# EAGLE schematic SteppyMk2 (EAGLE 9.2.2)
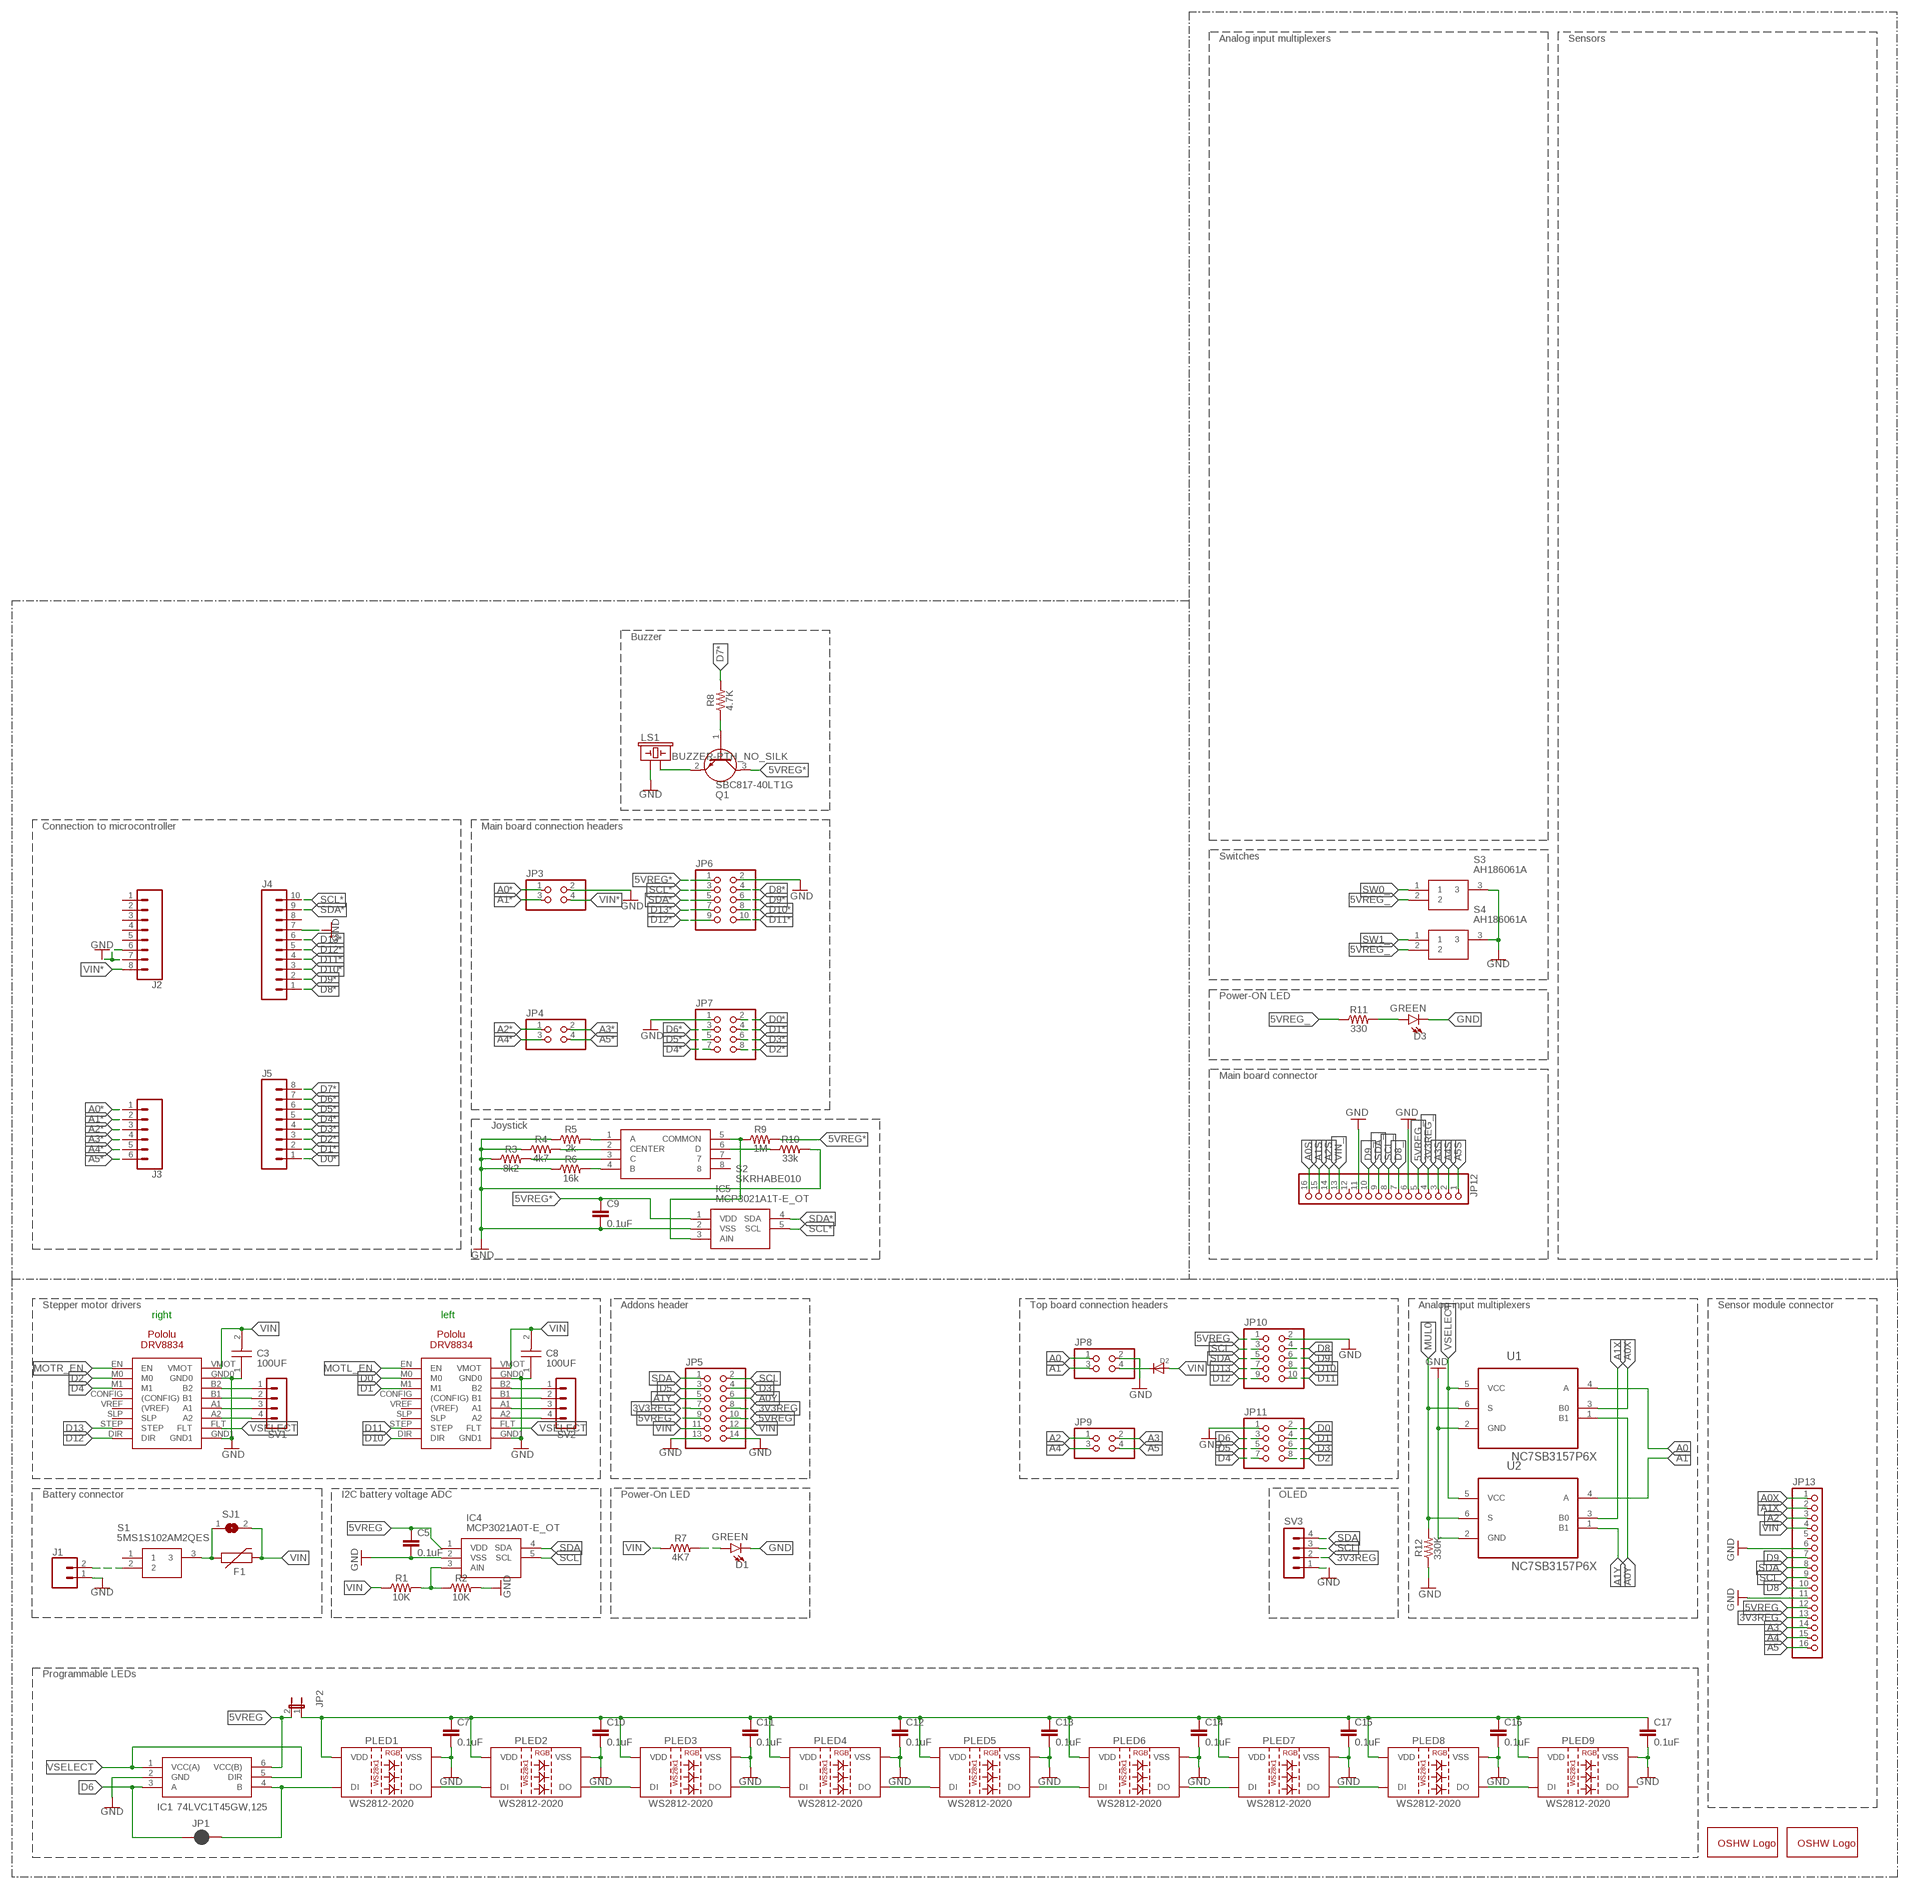
[diagram p0: schematic, sheet 1, part 1 of 3]
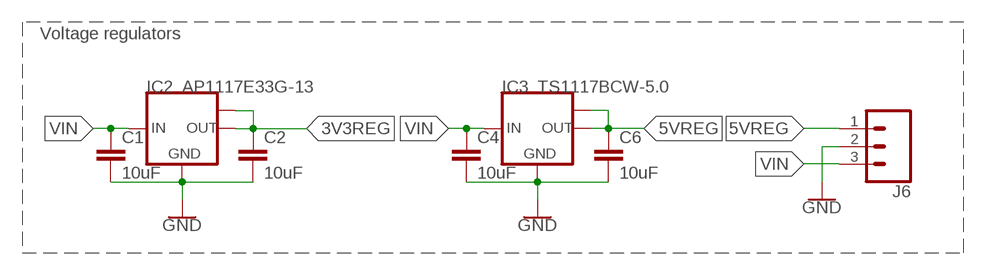
[diagram p1: schematic, sheet 1, part 2 of 3]
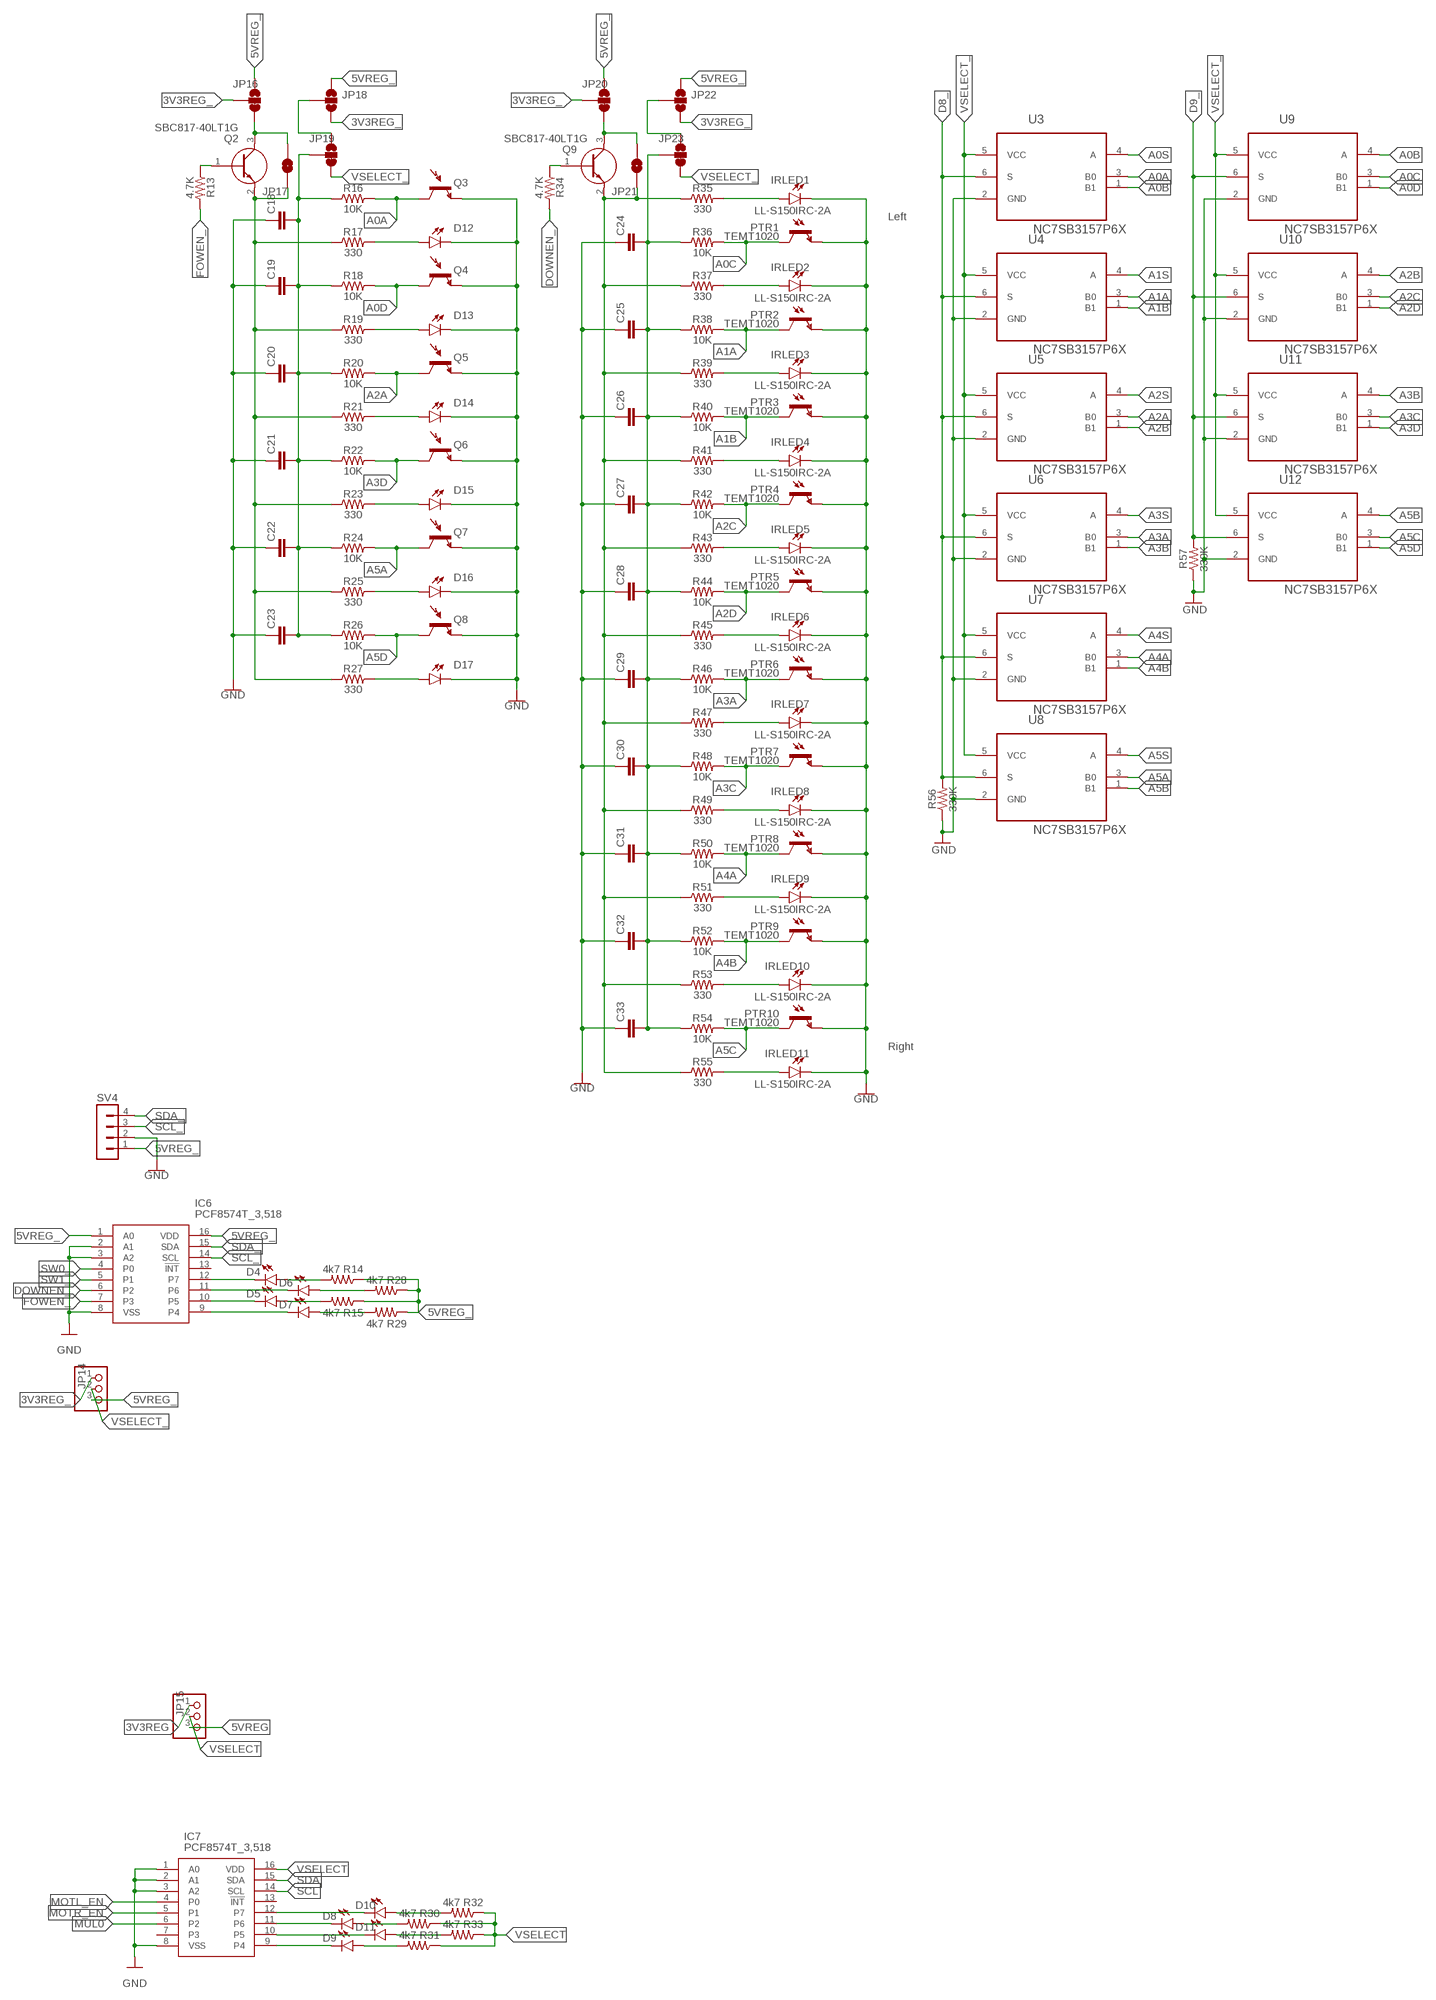
[diagram p2: schematic, sheet 1, part 3 of 3]

## Parts
C1  10uF  10UF-0805-10V-10%  [0805]
C2  10uF  10UF-0805-10V-10%  [0805]
C3  100UF  EEEFK1C101P  [CAPM7058X610N]
C4  10uF  10UF-0805-10V-10%  [0805]
C5  0.1uF  0.1UF-0603-25V-5%  [0603]
C6  10uF  10UF-0805-10V-10%  [0805]
C7  0.1uF  C-EUC0805  [C0805]
C8  100UF  EEEFK1C101P  [CAPM7058X610N]
C9  0.1uF  C-EUC0805  [C0805]
C10  0.1uF  C-EUC0805  [C0805]
C11  0.1uF  C-EUC0805  [C0805]
C12  0.1uF  C-EUC0805  [C0805]
C13  0.1uF  C-EUC0805  [C0805]
C14  0.1uF  C-EUC0805  [C0805]
C15  0.1uF  C-EUC0805  [C0805]
C16  0.1uF  C-EUC0805  [C0805]
C17  0.1uF  C-EUC0805  [C0805]
C18  C-EUC0805  [C0805]
C19  C-EUC0805  [C0805]
C20  C-EUC0805  [C0805]
C21  C-EUC0805  [C0805]
C22  C-EUC0805  [C0805]
C23  C-EUC0805  [C0805]
C24  C-EUC0805  [C0805]
C25  C-EUC0805  [C0805]
C26  C-EUC0805  [C0805]
C27  C-EUC0805  [C0805]
C28  C-EUC0805  [C0805]
C29  C-EUC0805  [C0805]
C30  C-EUC0805  [C0805]
C31  C-EUC0805  [C0805]
C32  C-EUC0805  [C0805]
C33  C-EUC0805  [C0805]
D1  GREEN  LED-GREEN1206  [LED-1206]
D2  DIODESMA  [SMADIODE]
D3  GREEN  LED-GREEN1206  [LED-1206]
D4  GREEN  LED-GREEN1206  [LED-1206]
D5  GREEN  LED-GREEN1206  [LED-1206]
D6  GREEN  LED-GREEN1206  [LED-1206]
D7  GREEN  LED-GREEN1206  [LED-1206]
D8  GREEN  LED-GREEN1206  [LED-1206]
D9  GREEN  LED-GREEN1206  [LED-1206]
D10  GREEN  LED-GREEN1206  [LED-1206]
D11  GREEN  LED-GREEN1206  [LED-1206]
D12  LED-IRSIDE_EMITTER  [LTE-302]
D13  LED-IRSIDE_EMITTER  [LTE-302]
D14  LED-IRSIDE_EMITTER  [LTE-302]
D15  LED-IRSIDE_EMITTER  [LTE-302]
D16  LED-IRSIDE_EMITTER  [LTE-302]
D17  LED-IRSIDE_EMITTER  [LTE-302]
DRV1  POLOLU-DRV8825  [POLOLU-DRV8825]
DRV2  POLOLU-DRV8825  [POLOLU-DRV8825]
F1  PPTC_PTH  [PTH]
GOLD_ORB_SM1  OSHWLOGOLOGO8MM  [OSHW_8MM]
GOLD_ORB_SM2  OSHWLOGOLOGO5MM  [OSHW_5MM]
IC1  74LVC1T45GW,125  [SOT65P210X110-6N]
IC2  AP1117E33G-13  LM1117IMPX-3.3  [SOT223]
IC3  TS1117BCW-5.0  LM1117IMPX-5.0  [SOT223]
IC4  MCP3021A0T-E_OT  [SOT95P280X145-5N]
IC5  MCP3021A1T-E_OT  MCP3021A0T-E_OT  [SOT95P280X145-5N]
IC6  PCF8574T_3,518  [SOIC127P1032X265-16N]
IC7  PCF8574T_3,518  [SOIC127P1032X265-16N]
IRLED1  LL-S150IRC-2A  PT15-21C_TR8  [LEDC3215X130N]
IRLED2  LL-S150IRC-2A  PT15-21C_TR8  [LEDC3215X130N]
IRLED3  LL-S150IRC-2A  PT15-21C_TR8  [LEDC3215X130N]
IRLED4  LL-S150IRC-2A  PT15-21C_TR8  [LEDC3215X130N]
IRLED5  LL-S150IRC-2A  PT15-21C_TR8  [LEDC3215X130N]
IRLED6  LL-S150IRC-2A  PT15-21C_TR8  [LEDC3215X130N]
IRLED7  LL-S150IRC-2A  PT15-21C_TR8  [LEDC3215X130N]
IRLED8  LL-S150IRC-2A  PT15-21C_TR8  [LEDC3215X130N]
IRLED9  LL-S150IRC-2A  PT15-21C_TR8  [LEDC3215X130N]
IRLED10  LL-S150IRC-2A  PT15-21C_TR8  [LEDC3215X130N]
IRLED11  LL-S150IRC-2A  PT15-21C_TR8  [LEDC3215X130N]
J1  CONN_02  [1X02]
J2  CONN_08"  [1X08]
J3  CONN_06SILK_FEMALE_PTH  [1X06]
J4  CONN_10"  [1X10]
J5  CONN_08"  [1X08]
J6  455-1750-1-ND  CONN_03  [1X03]
JP1  JUMPER-SMT_2_NC_PASTE_SILK  [SMT-JUMPER_2_NC_PASTE_SILK]
JP2  JP1E  [JP1]
JP3  PINHD-2X2  [2X02]
JP4  PINHD-2X2  [2X02]
JP5  PINHD-2X7  [2X07]
JP6  PINHD-2X5  [2X05]
JP7  PINHD-2X4  [2X04]
JP8  PINHD-2X2  [2X02]
JP9  PINHD-2X2  [2X02]
JP10  PINHD-2X5  [2X05]
JP11  PINHD-2X4  [2X04]
JP12  PINHD-1X16/90  [1X16/90]
JP13  PINHD-1X16  [1X16]
JP14  PINHD-1X3  [1X03]
JP15  PINHD-1X3  [1X03]
JP16  JUMPER-SMT_3_1-NC_TRACE_NO-SILK  [SMT-JUMPER_3_1-NC_TRACE_NO-SILK]
JP17  JUMPER-SMT_2_NO_NO-SILK  [SMT-JUMPER_2_NO_NO-SILK]
JP18  JUMPER-SMT_3_NO_NO_SILK  [SMT-JUMPER_3_0-NO_TRACE_NO-SILK]
JP19  JUMPER-SMT_3_1-NC_TRACE_NO-SILK  [SMT-JUMPER_3_1-NC_TRACE_NO-SILK]
JP20  JUMPER-SMT_3_1-NC_TRACE_NO-SILK  [SMT-JUMPER_3_1-NC_TRACE_NO-SILK]
JP21  JUMPER-SMT_2_NO_NO-SILK  [SMT-JUMPER_2_NO_NO-SILK]
JP22  JUMPER-SMT_3_NO_NO_SILK  [SMT-JUMPER_3_0-NO_TRACE_NO-SILK]
JP23  JUMPER-SMT_3_1-NC_TRACE_NO-SILK  [SMT-JUMPER_3_1-NC_TRACE_NO-SILK]
LS1  BUZZER-PTH_NO_SILK  [BUZZER-12MM-NS]
PLED1  WS2812-2020  [WS2812-2020]
PLED2  WS2812-2020  [WS2812-2020]
PLED3  WS2812-2020  [WS2812-2020]
PLED4  WS2812-2020  [WS2812-2020]
PLED5  WS2812-2020  [WS2812-2020]
PLED6  WS2812-2020  [WS2812-2020]
PLED7  WS2812-2020  [WS2812-2020]
PLED8  WS2812-2020  [WS2812-2020]
PLED9  WS2812-2020  [WS2812-2020]
PTR1  TEMT1020  [TEMT1020]
PTR2  TEMT1020  [TEMT1020]
PTR3  TEMT1020  [TEMT1020]
PTR4  TEMT1020  [TEMT1020]
PTR5  TEMT1020  [TEMT1020]
PTR6  TEMT1020  [TEMT1020]
PTR7  TEMT1020  [TEMT1020]
PTR8  TEMT1020  [TEMT1020]
PTR9  TEMT1020  [TEMT1020]
PTR10  TEMT1020  [TEMT1020]
Q1  SBC817-40LT1G  [SOT96P237X111-3N]
Q2  SBC817-40LT1G  [SOT96P237X111-3N]
Q3  LTR-301  [LTR-301]
Q4  LTR-301  [LTR-301]
Q5  LTR-301  [LTR-301]
Q6  LTR-301  [LTR-301]
Q7  LTR-301  [LTR-301]
Q8  LTR-301  [LTR-301]
Q9  SBC817-40LT1G  [SOT96P237X111-3N]
R1  10K  RESISTOR0805  [0805]
R2  10K  RESISTOR0805  [0805]
R3  8k2  RESISTOR0805  [0805]
R4  4k7  RESISTOR0805  [0805]
R5  2k  RESISTOR0805  [0805]
R6  16k  RESISTOR0805  [0805]
R7  4K7  RESISTOR0805  [0805]
R8  4.7K  RESISTOR0805  [0805]
R9  1M  RESISTOR0805  [0805]
R10  33k  RESISTOR0805  [0805]
R11  330  RESISTOR0805  [0805]
R12  330K  RESISTOR0805  [0805]
R13  4.7K  RESISTOR0805  [0805]
R14  4k7  RESISTOR0805  [0805]
R15  4k7  RESISTOR0805  [0805]
R16  10K  RESISTOR0805  [0805]
R17  330  RESISTOR0805  [0805]
R18  10K  RESISTOR0805  [0805]
R19  330  RESISTOR0805  [0805]
R20  10K  RESISTOR0805  [0805]
R21  330  RESISTOR0805  [0805]
R22  10K  RESISTOR0805  [0805]
R23  330  RESISTOR0805  [0805]
R24  10K  RESISTOR0805  [0805]
R25  330  RESISTOR0805  [0805]
R26  10K  RESISTOR0805  [0805]
R27  330  RESISTOR0805  [0805]
R28  4k7  RESISTOR0805  [0805]
R29  4k7  RESISTOR0805  [0805]
R30  4k7  RESISTOR0805  [0805]
R31  4k7  RESISTOR0805  [0805]
R32  4k7  RESISTOR0805  [0805]
R33  4k7  RESISTOR0805  [0805]
R34  4.7K  RESISTOR0805  [0805]
R35  330  RESISTOR0805  [0805]
R36  10K  RESISTOR0805  [0805]
R37  330  RESISTOR0805  [0805]
R38  10K  RESISTOR0805  [0805]
R39  330  RESISTOR0805  [0805]
R40  10K  RESISTOR0805  [0805]
R41  330  RESISTOR0805  [0805]
R42  10K  RESISTOR0805  [0805]
R43  330  RESISTOR0805  [0805]
R44  10K  RESISTOR0805  [0805]
R45  330  RESISTOR0805  [0805]
R46  10K  RESISTOR0805  [0805]
R47  330  RESISTOR0805  [0805]
R48  10K  RESISTOR0805  [0805]
R49  330  RESISTOR0805  [0805]
R50  10K  RESISTOR0805  [0805]
R51  330  RESISTOR0805  [0805]
R52  10K  RESISTOR0805  [0805]
R53  330  RESISTOR0805  [0805]
R54  10K  RESISTOR0805  [0805]
R55  330  RESISTOR0805  [0805]
R56  330K  RESISTOR0805  [0805]
R57  330K  RESISTOR0805  [0805]
S1  5MS1S102AM2QES  [5MS1S102AM2QES]
S2  SKRHABE010  [SKRHABE010]
S3  AH186061A  [AH186061A]
S4  AH186061A  [AH186061A]
SJ1  SJW  [SJW]
SV1  MA04-1  [MA04-1]
SV2  MA04-1  [MA04-1]
SV3  MA04-1  [MA04-1]
SV4  MA04-1  [MA04-1]
U1  NC7SB3157P6X  [SOT65P210X110-6N]
U2  NC7SB3157P6X  [SOT65P210X110-6N]
U3  NC7SB3157P6X  [SOT65P210X110-6N]
U4  NC7SB3157P6X  [SOT65P210X110-6N]
U5  NC7SB3157P6X  [SOT65P210X110-6N]
U6  NC7SB3157P6X  [SOT65P210X110-6N]
U7  NC7SB3157P6X  [SOT65P210X110-6N]
U8  NC7SB3157P6X  [SOT65P210X110-6N]
U9  NC7SB3157P6X  [SOT65P210X110-6N]
U10  NC7SB3157P6X  [SOT65P210X110-6N]
U11  NC7SB3157P6X  [SOT65P210X110-6N]
U12  NC7SB3157P6X  [SOT65P210X110-6N]

## Nets
3V3REG: C2.1 IC2.2(OUT) IC2.TAB(OUT1) JP5.7 JP5.8 JP13.13 JP15.1 SV3.2
3V3REG_: JP12.4 JP14.1 JP16.2 JP18.3 JP20.2 JP22.3
5VREG: C5.1 C6.1 IC1.6(VCC(B)) IC3.2(OUT) IC3.TAB(OUT1) IC4.1(VDD) J6.1 JP2.2 JP5.9 JP5.10 JP10.1 JP13.12 JP15.3
5VREG*: C9.1 IC5.1(VDD) JP6.1 Q1.3(C) R9.2
5VREG_: IC6.1(A0) IC6.16(VDD) JP12.5 JP14.3 JP16.1 JP18.1 JP20.1 JP22.1 R11.1 R14.1 R15.1 R28.1 R29.1 S3.2 S4.2 SV4.1
A0: JP8.1 U1.4(A)
A0*: J3.1 JP3.1
A0A: Q3.C(C1) R16.2 U3.3(B0)
A0B: U3.1(B1) U9.4(A)
A0C: PTR1.1(C) R36.2 U9.3(B0)
A0D: Q4.C(C1) R18.2 U9.1(B1)
A0S: JP12.16 U3.4(A)
A0X: JP13.1 U1.3(B0)
A0Y: JP5.6 U1.1(B1)
A1: JP8.3 U2.4(A)
A1*: J3.2 JP3.3
A1A: PTR2.1(C) R38.2 U4.3(B0)
A1B: PTR3.1(C) R40.2 U4.1(B1)
A1S: JP12.15 U4.4(A)
A1X: JP13.2 U2.3(B0)
A1Y: JP5.5 U2.1(B1)
A2: JP9.1 JP13.3
A2*: J3.3 JP4.1
A2A: Q5.C(C1) R20.2 U5.3(B0)
A2B: U5.1(B1) U10.4(A)
A2C: PTR4.1(C) R42.2 U10.3(B0)
A2D: PTR5.1(C) R44.2 U10.1(B1)
A2S: JP12.14 U5.4(A)
A3: JP9.2 JP13.14
A3*: J3.4 JP4.2
A3A: PTR6.1(C) R46.2 U6.3(B0)
A3B: U6.1(B1) U11.4(A)
A3C: PTR7.1(C) R48.2 U11.3(B0)
A3D: Q6.C(C1) R22.2 U11.1(B1)
A3S: JP12.3 U6.4(A)
A4: JP9.3 JP13.15
A4*: J3.5 JP4.3
A4A: PTR8.1(C) R50.2 U7.3(B0)
A4B: PTR9.1(C) R52.2 U7.1(B1)
A4S: JP12.2 U7.4(A)
A5: JP9.4 JP13.16
A5*: J3.6 JP4.4
A5A: Q7.C(C1) R24.2 U8.3(B0)
A5B: U8.1(B1) U12.4(A)
A5C: PTR10.1(C) R54.2 U12.3(B0)
A5D: Q8.C(C1) R26.2 U12.1(B1)
A5S: JP12.1 U8.4(A)
D0: DRV2.M0 JP11.2
D0*: J5.1 JP7.2
D1: DRV2.M1 JP11.4
D1*: J5.2 JP7.4
D2: DRV1.M0 JP11.8
D2*: J5.3 JP7.8
D3: JP5.4 JP11.6
D3*: J5.4 JP7.6
D4: DRV1.M1 JP11.7
D4*: J5.5 JP7.7
D5: JP5.3 JP11.5
D5*: J5.6 JP7.5
D6: IC1.3(A) JP1.1 JP11.3
D6*: J5.7 JP7.3
D7*: J5.8 R8.2
D8: JP10.4 JP13.10
D8*: J4.1 JP6.4
D8_: JP12.7 R56.2 U3.6(S) U4.6(S) U5.6(S) U6.6(S) U7.6(S) U8.6(S)
D9: JP10.6 JP13.7
D9*: J4.2 JP6.6
D9_: JP12.10 R57.2 U9.6(S) U10.6(S) U11.6(S) U12.6(S)
D10: DRV2.DIR JP10.8
D10*: J4.3 JP6.8
D11: DRV2.STEP JP10.10
D11*: J4.4 JP6.10
D12: DRV1.DIR JP10.9
D12*: J4.5 JP6.9
D13: DRV1.STEP JP10.7
D13*: J4.6 JP6.7
DOWNEN_: IC6.6(P2) R34.2
FOWEN_: IC6.7(P3) R13.2
GND: C1.2 C2.2 C3.1 C4.2 C5.2 C6.2 C7.2 C8.1 C9.2 C10.2 C11.2 C12.2 C13.2 C14.2 C15.2 C16.2 C17.2 C18.1 C19.1 C20.1 C21.1 C22.1 C23.1 C24.1 C25.1 C26.1 C27.1 C28.1 C29.1 C30.1 C31.1 C32.1 C33.1 D1.C D3.C D12.C D13.C D14.C D15.C D16.C D17.C DRV1.GND0 DRV1.GND1 DRV2.GND0 DRV2.GND1 IC1.2(GND) IC2.1(GND) IC3.1(GND) IC4.2(VSS) IC5.2(VSS) IC6.2(A1) IC6.3(A2) IC6.8(VSS) IC7.1(A0) IC7.2(A1) IC7.3(A2) IC7.8(VSS) IRLED1.2(C) IRLED2.2(C) IRLED3.2(C) IRLED4.2(C) IRLED5.2(C) IRLED6.2(C) IRLED7.2(C) IRLED8.2(C) IRLED9.2(C) IRLED10.2(C) IRLED11.2(C) J1.1 J2.6 J2.7 J4.7 J6.2 JP3.2 JP5.13 JP5.14 JP6.2 JP7.1 JP8.2 JP10.2 JP11.1 JP12.6 JP12.11 JP13.6 JP13.11 LS1.+ PLED1.2(VSS) PLED2.2(VSS) PLED3.2(VSS) PLED4.2(VSS) PLED5.2(VSS) PLED6.2(VSS) PLED7.2(VSS) PLED8.2(VSS) PLED9.2(VSS) PTR1.2(E) PTR2.2(E) PTR3.2(E) PTR4.2(E) PTR5.2(E) PTR6.2(E) PTR7.2(E) PTR8.2(E) PTR9.2(E) PTR10.2(E) Q3.E(E1) Q4.E(E1) Q5.E(E1) Q6.E(E1) Q7.E(E1) Q8.E(E1) R2.2 R3.1 R4.1 R5.1 R6.1 R10.2 R12.1 R56.1 R57.1 S3.3 S4.3 SV3.1 SV4.2 U1.2(GND) U2.2(GND) U3.2(GND) U4.2(GND) U5.2(GND) U6.2(GND) U7.2(GND) U8.2(GND) U9.2(GND) U10.2(GND) U11.2(GND) U12.2(GND)
GND1: D6.C IC6.11(P6)
GND2: D5.C IC6.10(P5)
GND3: D7.C IC6.9(P4)
MOTL_EN: DRV2.EN IC7.4(P0)
MOTR_EN: DRV1.EN IC7.5(P1)
MUL0: IC7.6(P2) R12.2 U1.6(S) U2.6(S)
N$1: IRLED9.1(A) R51.2
N$2: IRLED2.1(A) R37.2
N$3: D4.A R14.2
N$4: D2.C JP8.4
N$5: Q2.1(B) R13.1
N$6: IRLED1.1(A) R35.2
N$7: IC1.4(B) JP1.2 PLED1.3(DI)
N$8: D8.A R30.2
N$9: D11.C IC7.10(P5)
N$10: D9.A R31.2
N$12: PLED6.1(DO) PLED7.3(DI)
N$13: IRLED3.1(A) R39.2
N$14: PLED7.1(DO) PLED8.3(DI)
N$15: PLED8.1(DO) PLED9.3(DI)
N$16: D1.A R7.2
N$17: DRV2.B2 SV2.1
N$18: DRV2.B1 SV2.2
N$19: DRV2.A1 SV2.3
N$20: DRV2.A2 SV2.4
N$21: D6.A R28.2
N$22: R6.2 S2.4(B)
N$23: D3.A R11.2
N$24: IRLED4.1(A) R41.2
N$25: D5.A R15.2
N$26: R3.2 S2.3(C)
N$27: DRV1.B2 SV1.1
N$28: DRV1.B1 SV1.2
N$29: DRV1.A1 SV1.3
N$30: DRV1.A2 SV1.4
N$31: J1.2 S1.2
N$32: R4.2 S2.2(CENTER)
N$33: LS1.- Q1.2(E)
N$34: Q1.1(B) R8.1
N$35: IC4.3(AIN) R1.2 R2.1
N$36: R5.2 S2.1(A)
N$37: D10.C IC7.12(P7)
N$38: IC5.3(AIN) R9.1 S2.5(COMMON)
N$39: R10.1 S2.6(D)
N$40: D8.C IC7.11(P6)
N$41: D7.A R29.2
N$42: D9.C IC7.9(P4)
N$43: D11.A R33.2
N$44: D10.A R32.2
N$45: C7.1 C10.1 C11.1 C12.1 C13.1 C14.1 C15.1 C16.1 C17.1 JP2.1 PLED1.4(VDD) PLED2.4(VDD) PLED3.4(VDD) PLED4.4(VDD) PLED5.4(VDD) PLED6.4(VDD) PLED7.4(VDD) PLED8.4(VDD) PLED9.4(VDD)
N$47: IRLED5.1(A) R43.2
N$48: PLED2.1(DO) PLED3.3(DI)
N$50: PLED3.1(DO) PLED4.3(DI)
N$51: IRLED6.1(A) R45.2
N$53: PLED4.1(DO) PLED5.3(DI)
N$55: IRLED7.1(A) R47.2
N$56: PLED5.1(DO) PLED6.3(DI)
N$58: JP16.3 JP17.2 Q2.3(C)
N$59: IRLED8.1(A) R49.2
N$60: JP18.2 JP19.1
N$61: PLED1.1(DO) PLED2.3(DI)
N$62: JP22.2 JP23.1
N$63: JP20.3 JP21.2 Q9.3(C)
N$64: D4.C IC6.12(P7)
N$68: IRLED10.1(A) R53.2
N$73: IRLED11.1(A) R55.2
N$75: D12.A R17.2
N$76: D13.A R19.2
N$77: Q9.1(B) R34.1
N$84: D14.A R21.2
N$86: F1.P$1 S1.3 SJ1.1
N$87: D15.A R23.2
N$89: JP21.1 Q9.2(E) R35.1 R37.1 R39.1 R41.1 R43.1 R45.1 R47.1 R49.1 R51.1 R53.1 R55.1
N$95: D16.A R25.2
N$96: D17.A R27.2
N$99: JP17.1 Q2.2(E) R17.1 R19.1 R21.1 R23.1 R25.1 R27.1
NE9878: C24.2 C25.2 C26.2 C27.2 C28.2 C29.2 C30.2 C31.2 C32.2 C33.2 JP23.2 R36.1 R38.1 R40.1 R42.1 R44.1 R46.1 R48.1 R50.1 R52.1 R54.1
NET56SDFSF: C18.2 C19.2 C20.2 C21.2 C22.2 C23.2 JP19.2 R16.1 R18.1 R20.1 R22.1 R24.1 R26.1
SCL: IC4.5(SCL) IC7.14(SCL) JP5.2 JP10.3 JP13.9 SV3.3
SCL*: IC5.5(SCL) J4.10 JP6.3
SCL_: IC6.14(SCL) JP12.8 SV4.3
SDA: IC4.4(SDA) IC7.15(SDA) JP5.1 JP10.5 JP13.8 SV3.4
SDA*: IC5.4(SDA) J4.9 JP6.5
SDA_: IC6.15(SDA) JP12.9 SV4.4
SW0_: IC6.4(P0) S3.1
SW1_: IC6.5(P1) S4.1
VIN: C1.1 C3.2 C4.1 C8.2 D2.A DRV1.VMOT DRV2.VMOT F1.P$2 IC2.3(IN) IC3.3(IN) J6.3 JP5.11 JP5.12 JP13.4 R1.1 R7.1 SJ1.2
VIN*: J2.8 JP3.4
VIN_: JP12.13
VSELECT: DRV1.FLT DRV2.FLT IC1.1(VCC(A)) IC1.5(DIR) IC7.16(VDD) JP15.2 R30.1 R31.1 R32.1 R33.1 U1.5(VCC) U2.5(VCC)
VSELECT_: JP14.2 JP19.3 JP23.3 U3.5(VCC) U4.5(VCC) U5.5(VCC) U6.5(VCC) U7.5(VCC) U8.5(VCC) U9.5(VCC) U10.5(VCC) U11.5(VCC) U12.5(VCC)
Unconnected: DRV1.CONFIG((CONFIG)) DRV1.SLP DRV1.VREF((VREF)) DRV2.CONFIG((CONFIG)) DRV2.SLP DRV2.VREF((VREF)) IC6.13(!INT) IC7.7(P3) IC7.13(!INT) J2.1 J2.2 J2.3 J2.4 J2.5 J4.8 JP12.12 JP13.5 PLED9.1(DO) S1.1 S2.7 S2.8

## Notes on the sheet
- Analog input multiplexers | Sensors
- Left
- Buzzer
- Connection to microcontroller | Main board connection headers
- Right
- Switches
- Power-ON LED
- Main board connector
- Joystick
- Stepper motor drivers | Addons header | Top board connection headers | Analog input multiplexers | Sensor module connector
- right | left
- Battery connector | I2C battery voltage ADC | Power-On LED | OLED
- Programmable LEDs
- Voltage regulators

## Library data of the parts
C1 C2 C4 C6 = SparkFun-Capacitors:10UF: 10.0µF ceramic capacitors A capacitor is a passive two-terminal electrical component used to store electrical energy temporarily in an electric field.; PROD_ID: CAP-11330
C3 C8 = EEEFK1C101P:EEEFK1C101P: Ecap 100uF 16V D case Panasonic 100uF 16 V dc Aluminium Electrolytic Capacitor, FK SMD Series 2000h 6.3 Dia. x 5.8mm Source: Datasheet <http://uk.rs-online.com/web/p/products/5370433>; ALLIED_NUMBER: 70256494; ALLIED_PRICE-STOCK: https://www.alliedelec.com/panasonic-eee-fk1c101p/70256494/; DESCRIPTION: Ecap 100uF 16V D case Panasonic 100uF 16 V dc Aluminium Electrolytic Capacitor, FK SMD Series 2000h 6.3 Dia. x 5.8mm; HEIGHT: 6.1mm; MANUFACTURER_NAME: Panasonic; MANUFACTURER_PART_NUMBER: EEEFK1C101P; RS_PART_NUMBER: 5370433P; RS_PRICE-STOCK: http://uk.rs-online.com/web/p/products/5370433P
C5 = SparkFun-Capacitors:0.1UF: 0.1µF ceramic capacitors A capacitor is a passive two-terminal electrical component used to store electrical energy temporarily in an electric field.; PROD_ID: CAP-08604
C7 C9-C33 = rcl:C-EU: CAPACITOR, European symbol; SPICEPREFIX: C
D1 D3-D11 = SparkFun-LED:LED-GREEN: Green SMD LED Used in manufacturing of various products at SparkFun Packages: 0603 - SMD 0603 package [Product Link] <http://www.futureelectronics.com/en/technologies/semiconductors/optoelectronics/leds/Pages/9894312-LTST-C190GKT.aspx?CrossPart=HSMG-C190&IM=0> LilyPad 1206 - SMD1206 LilyPad package [Product Link] <http://www.futureelectronics.com/en/Technologies/Product.aspx?ProductID=IN150NGHARVATEKCORPORATION2049943&IM=0> 1206 - SMD1206 package [Product Link] <http://www.futureelectronics.com/en/technologies/semiconductors/optoelectronics/leds/Pages/8315665-LTST-C150KGKT.aspx?IM=0> 1206 Bottom Mount -SMD 1206 Bottom Mount [Product Link] <http://www.digikey.com/product-detail/en/lite-on-inc/LTST-C230KGKT/160-1456-1-ND/386854> SparkFun Products: Pro Mini 328 -5V <https://www.sparkfun.com/products/821> RedBoard <https://www.sparkfun.com/products/12757> MP3 Trigger <https://www.sparkfun.com/products/13720> Makey Makey <https://www.sparkfun.com/products/11076>; PROD_ID: DIO-00862
D2 = adafruit:DIODE: Diode SMADIODE - SMA Surface Mount Package 20V 1A Schottky Diode Digikey: 641-1014-6-ND DO-1N4148 - Through Hole Small Current Diode SOD-123 20V 1 A (.5mV Vf) Schottky Diode - Digikey: MBRX120TPMSCT-ND SOD-323 10V 570mA (.38mV Vf, 3ns) Schottky Diode - Digikey: ZLLS410CT-ND SOD-523 30V 30mA Schottky Diode (RB751S-40TE61) - Digikey: RB751S-40TE61CT-ND SOT23-R/W - SOT23 Package (R = Solder Paste/Reflow Ovens, W = Hand-Soldering) BAT54Film 40V 300mA - Digikey: 497-7162-1-ND
D12-D17 = SparkFun-LED:LED-IR: Infrared LED (IR) Wavelength: 940nm Packages: TSAL6100 LTE302 - Side firing. Check SparkFun-Sensors.lbr for the receiver SparkFun Products: ZX Distance and Gesture Sensor <[https://www.sparkfun.com/products/12780]> Infrared Emitters and Detectors <https://www.sparkfun.com/products/241>; PROD_ID: DIO-14163; SF_ID: SEN-00241
DRV1 DRV2 = alvarop-lib:POLOLU-DRV8825
F1 = SparkFun-Fuses:PPTC: Resettable Fuse PPTC Resettable Fuse. Really a sort of resistor with a polymeric positive temperature coefficient whose resistance increases dramatically with an increase in temperature. When heated by the power passing through the resistance rises causing the current to be limited, protecting the circuit. This is achieved by the transition of the polymer from a crystalline to an amorphous state where the conductive carbon separates breaking the conductive pathways found in the cool crystalline structure. When a PPTC cools back down it resumes conducting letting the circuit turn back on. SparkFun Products: SparkFun RedBoard - Programmed with Arduino <https://www.sparkfun.com/products/12757> Pro Micro - 5V/16MHz <https://www.sparkfun.com/products/12640> Arduino Pro 328 - 5V/16MHz <https://www.sparkfun.com/products/10915> MP3 Trigger <https://www.sparkfun.com/products/13720>; PROD_ID: RES-08490; VALUE: 72V/0.25A
GOLD_ORB_SM1 GOLD_ORB_SM2 = oshw:OSHWLOGO: The OSHW logo for PCB layout
IC1 = 74LVC1T45GW_125:74LVC1T45GW,125: NXP - 74LVC1T45GW,125 - TRANSCEIVER, 3 STATE, SOT-363-6 Source: Datasheet <https://componentsearchengine.com/Datasheets/2/74LVC1T45GW,125.pdf>; DESCRIPTION: NXP - 74LVC1T45GW,125 - TRANSCEIVER, 3 STATE, SOT-363-6; HEIGHT: 1.1mm; MANUFACTURER_NAME: Nexperia; MANUFACTURER_PART_NUMBER: 74LVC1T45GW,125; MOUSER_PART_NUMBER: 771-74LVC1T45GW125; MOUSER_PRICE-STOCK: https://www.mouser.com/Search/Refine.aspx?Keyword=771-74LVC1T45GW125; RS_PART_NUMBER: 8168791P; RS_PRICE-STOCK: http://befr.rs-online.com/web/p/products/8168791P
IC2 IC3 = lm1117:LM1117IMPX-*
IC4 IC5 = MCP3021A0T-E_OT:MCP3021A0T-E_OT: MICROCHIP - MCP3021A0T-E/OT - ADC, AEC-Q100, SAR, 10BIT, SOT-23-5 Source: Datasheet <http://ww1.microchip.com/downloads/en/DeviceDoc/20001805C.pdf>; ALLIED_NUMBER: 70451980; ALLIED_PRICE-STOCK: https://www.alliedelec.com/microchip-technology-inc-mcp3021a0t-e-ot/70451980/; DESCRIPTION: MICROCHIP - MCP3021A0T-E/OT - ADC, AEC-Q100, SAR, 10BIT, SOT-23-5; HEIGHT: 1.45mm; MANUFACTURER_NAME: Microchip; MANUFACTURER_PART_NUMBER: MCP3021A0T-E/OT; MOUSER_PART_NUMBER: 579-MCP3021A0T-E/OT; MOUSER_PRICE-STOCK: https://www.mouser.com/Search/Refine.aspx?Keyword=579-MCP3021A0T-E%2FOT
IC6 IC7 = PCF8574T_3_518:PCF8574T_3,518: NXP - PCF8574T/3,518 - IC, I/O EXPANDER, 8BIT, SOIC16 Source: Datasheet <https://www.nxp.com/docs/en/data-sheet/PCF8574_PCF8574A.pdf>; DESCRIPTION: NXP - PCF8574T/3,518 - IC, I/O EXPANDER, 8BIT, SOIC16; HEIGHT: 2.65mm; MANUFACTURER_NAME: NXP; MANUFACTURER_PART_NUMBER: PCF8574T/3,518; MOUSER_PART_NUMBER: 771-PCF8574TD-T
IRLED1-IRLED11 = PT15-21C_TR8:PT15-21C_TR8: Phototransistors IR Phototransistor Source: Datasheet <http://www.everlight.com/file/ProductFile/PT15-21C-TR8.pdf>; DESCRIPTION: Phototransistors IR Phototransistor; HEIGHT: 1.3mm; MANUFACTURER_NAME: Everlight; MANUFACTURER_PART_NUMBER: PT15-21C/TR8; MOUSER_PART_NUMBER: 638-PT1521CTR8; MOUSER_PRICE-STOCK: https://www.mouser.com/Search/Refine.aspx?Keyword=638-PT1521CTR8
J1 = SparkFun-Connectors:CONN_02: Multi connection point. Often used as Generic Header-pin footprint for 0.1 inch spaced/style header connections On any of the 0.1 inch spaced packages, you can populate with these: Break Away Headers - Straight <https://www.sparkfun.com/products/116> (PRT-00116) Break Away Male Headers - Right Angle <https://www.sparkfun.com/products/553> (PRT-00553) Female Headers <https://www.sparkfun.com/products/115> (PRT-00115) Break Away Headers - Machine Pin <https://www.sparkfun.com/products/117> (PRT-00117) Break Away Female Headers - Swiss Machine Pin <https://www.sparkfun.com/products/743> (PRT-00743) For SCREWTERMINALS and SPRING TERMINALS visit here: Screw Terimnals on SparkFun.com <https://www.sparkfun.com/search/results?term=Screw+Terminals> (5mm/3.5mm/2.54mm spacing) This device is also useful as a general connection point to wire up your design to another part of your project. Our various solder wires solder well into these plated through hole pads. Hook-Up Wire - Assortment (Stranded, 22 AWG) <https://www.sparkfun.com/products/11375> (PRT-11375) Hook-Up Wire - Assortment (Solid Core, 22 AWG) <https://www.sparkfun.com/products/11367> (PRT-11367) View the entire wire category on our website here <https://www.sparkfun.com/categories/141> Special notes: Molex polarized connector foot print use with: PRT-08233 with associated crimp pins and housings. 2.54_SCREWTERM for use with PRT-10571. 3.5mm Screw Terminal footprints for PRT-08084 5mm Screw Terminal footprints for use with PRT-08432
J2 J5 = SparkFun-Connectors:CONN_08: Multi connection point. Often used as Generic Header-pin footprint for 0.1 inch spaced/style header connections On any of the 0.1 inch spaced packages, you can populate with these: Break Away Headers - Straight <https://www.sparkfun.com/products/116> (PRT-00116) Break Away Male Headers - Right Angle <https://www.sparkfun.com/products/553> (PRT-00553) Female Headers <https://www.sparkfun.com/products/115> (PRT-00115) Break Away Headers - Machine Pin <https://www.sparkfun.com/products/117> (PRT-00117) Break Away Female Headers - Swiss Machine Pin <https://www.sparkfun.com/products/743> (PRT-00743) Arduino Stackable Header - 8 Pin <https://www.sparkfun.com/products/9279> (PRT-09279) For SCREWTERMINALS and SPRING TERMINALS visit here: Screw Terimnals on SparkFun.com <https://www.sparkfun.com/search/results?term=Screw+Terminals> (5mm/3.5mm/2.54mm spacing) This device is also useful as a general connection point to wire up your design to another part of your project. Our various solder wires solder well into these plated through hole pads. Hook-Up Wire - Assortment (Stranded, 22 AWG) <https://www.sparkfun.com/products/11375> (PRT-11375) Hook-Up Wire - Assortment (Solid Core, 22 AWG) <https://www.sparkfun.com/products/11367> (PRT-11367) View the entire wire category on our website here <https://www.sparkfun.com/categories/141> Special notes: Molex polarized connector foot print use with SKU : PRT-08231 with associated crimp pins and housings. 1MM SMD Version SKU: PRT-10208 NOTES ON THE VARIANTS LOCK and LOCK_LONGPADS... This footprint was designed to help hold the alignment of a through-hole component (i.e. 6-pin header) while soldering it into place. You may notice that each hole has been shifted either up or down by 0.005 of an inch from it's more standard position (which is a perfectly straight line). This slight alteration caused the pins (the squares in the middle) to touch the edges of the holes. Because they are alternating, it causes a "brace" to hold the component in place. 0.005 has proven to be the perfect amount of "off-center" position when using our standard breakaway headers. Although looks a little odd when you look at the bare footprint, once you have a header in there, the alteration is very hard to notice. Also,if you push a header all the way into place, it is covered up entirely on the bottom side.; PROD_ID: CONN-08438
J3 = SparkFun-Connectors:CONN_06: Multi connection point. Often used as Generic Header-pin footprint for 0.1 inch spaced/style header connections On any of the 0.1 inch spaced packages, you can populate with these: Break Away Headers - Straight <https://www.sparkfun.com/products/116> (PRT-00116) Break Away Male Headers - Right Angle <https://www.sparkfun.com/products/553> (PRT-00553) Female Headers <https://www.sparkfun.com/products/115> (PRT-00115) Break Away Headers - Machine Pin <https://www.sparkfun.com/products/117> (PRT-00117) Break Away Female Headers - Swiss Machine Pin <https://www.sparkfun.com/products/743> (PRT-00743) Arduino Stackable Header - 6 Pin <https://www.sparkfun.com/products/9280> (PRT-09280) For SCREWTERMINALS and SPRING TERMINALS visit here: Screw Terimnals on SparkFun.com <https://www.sparkfun.com/search/results?term=Screw+Terminals> (5mm/3.5mm/2.54mm spacing) This device is also useful as a general connection point to wire up your design to another part of your project. Our various solder wires solder well into these plated through hole pads. Hook-Up Wire - Assortment (Stranded, 22 AWG) <https://www.sparkfun.com/products/11375> (PRT-11375) Hook-Up Wire - Assortment (Solid Core, 22 AWG) <https://www.sparkfun.com/products/11367> (PRT-11367) View the entire wire category on our website here <https://www.sparkfun.com/categories/141>; PROD_ID: CONN-08437
J4 = SparkFun-Connectors:CONN_10: Multi connection point. Often used as Generic Header-pin footprint for 0.1 inch spaced/style header connections On any of the 0.1 inch spaced packages, you can populate with these: Break Away Headers - Straight <https://www.sparkfun.com/products/116> (PRT-00116) Break Away Male Headers - Right Angle <https://www.sparkfun.com/products/553> (PRT-00553) Female Headers <https://www.sparkfun.com/products/115> (PRT-00115) Break Away Headers - Machine Pin <https://www.sparkfun.com/products/117> (PRT-00117) Break Away Female Headers - Swiss Machine Pin <https://www.sparkfun.com/products/743> (PRT-00743) Arduino Stackable Header - 10 Pin <https://www.sparkfun.com/products/11376> (PRT-11376) For SCREWTERMINALS and SPRING TERMINALS visit here: Screw Terimnals on SparkFun.com <https://www.sparkfun.com/search/results?term=Screw+Terminals> (5mm/3.5mm/2.54mm spacing) This device is also useful as a general connection point to wire up your design to another part of your project. Our various solder wires solder well into these plated through hole pads. Hook-Up Wire - Assortment (Stranded, 22 AWG) <https://www.sparkfun.com/products/11375> (PRT-11375) Hook-Up Wire - Assortment (Solid Core, 22 AWG) <https://www.sparkfun.com/products/11367> (PRT-11367) View the entire wire category on our website here <https://www.sparkfun.com/categories/141> Special notes: Molex polarized connector foot print use with SKU : PRT-08231 with associated crimp pins and housings. 1MM SMD Version SKU: PRT-10208 NOTES ON THE VARIANTS LOCK and LOCK_LONGPADS... This footprint was designed to help hold the alignment of a through-hole component (i.e. 6-pin header) while soldering it into place. You may notice that each hole has been shifted either up or down by 0.005 of an inch from it's more standard position (which is a perfectly straight line). This slight alteration caused the pins (the squares in the middle) to touch the edges of the holes. Because they are alternating, it causes a "brace" to hold the component in place. 0.005 has proven to be the perfect amount of "off-center" position when using our standard breakaway headers. Although looks a little odd when you look at the bare footprint, once you have a header in there, the alteration is very hard to notice. Also,if you push a header all the way into place, it is covered up entirely on the bottom side.; PROD_ID: CONN-11563
J6 = SparkFun-Connectors:CONN_03: Multi connection point. Often used as Generic Header-pin footprint for 0.1 inch spaced/style header connections On any of the 0.1 inch spaced packages, you can populate with these: Break Away Headers - Straight <https://www.sparkfun.com/products/116> (PRT-00116) Break Away Male Headers - Right Angle <https://www.sparkfun.com/products/553> (PRT-00553) Female Headers <https://www.sparkfun.com/products/115> (PRT-00115) Break Away Headers - Machine Pin <https://www.sparkfun.com/products/117> (PRT-00117) Break Away Female Headers - Swiss Machine Pin <https://www.sparkfun.com/products/743> (PRT-00743) Stackable Header - 3 Pin (Female, 0.1") <https://www.sparkfun.com/products/13875> (PRT-13875) For SCREWTERMINALS and SPRING TERMINALS visit here: Screw Terimnals on SparkFun.com <https://www.sparkfun.com/search/results?term=Screw+Terminals> (5mm/3.5mm/2.54mm spacing) This device is also useful as a general connection point to wire up your design to another part of your project. Our various solder wires solder well into these plated through hole pads. Hook-Up Wire - Assortment (Stranded, 22 AWG) <https://www.sparkfun.com/products/11375> (PRT-11375) Hook-Up Wire - Assortment (Solid Core, 22 AWG) <https://www.sparkfun.com/products/11367> (PRT-11367) View the entire wire category on our website here <https://www.sparkfun.com/categories/141> Special notes: Molex polarized connector foot print use with SKU : PRT-08232 with associated crimp pins and housings.; PROD_ID: XXX-00000
JP1 = SparkFun-Jumpers:JUMPER-SMT_2_NC_PASTE: Normally closed solder jumper This jumper has an aperture in the stencil to allow solder paste to bridge the split in the wire so it's normally closed (NC). Wick off the solder to open the connection. Reapply solder to reclose the connection.
JP2 = jumper:JP1E: JUMPER
JP3 JP4 JP8 JP9 = pinhead:PINHD-2X2: PIN HEADER
JP5 = pinhead:PINHD-2X7: PIN HEADER
JP6 JP10 = pinhead:PINHD-2X5: PIN HEADER
JP7 JP11 = pinhead:PINHD-2X4: PIN HEADER
JP12 JP13 = pinhead:PINHD-1X16: PIN HEADER
JP14 JP15 = adafruit:PINHD-1X3: PIN HEADER
JP16 JP19 JP20 JP23 = SparkFun-Jumpers:JUMPER-SMT_3_1-NC_TRACE: Normally closed trace jumper (1 of 2 connections) This jumper has a trace between two pads so it's normally closed (NC). The other connection is normally open (NO). Use a razor knife to open the connection. For best results follow the IPC guidelines for cutting traces: Cutout at least 0.063 mm (0.005 in). Remove all loose material to clean up the cut area. Seal the cut with an approved epoxy. Reapply solder to reclose the connection, or to close the NO connection.
JP17 JP21 = SparkFun-Jumpers:JUMPER-SMT_2_NO: Normally open jumper This jumper has two pads in close proximity to each other. Apply solder to close the connection. Round pads are easier to solder for beginners, but are a lot larger. SparkFun Product that uses the round pads: SparkFun EL Sequencer <https://www.sparkfun.com/products/12781>
JP18 JP22 = SparkFun-Jumpers:JUMPER-SMT_3_NO: Normally open jumper This jumper has three pads in close proximity to each other. Apply solder to close the connection(s).
LS1 = SparkFun-Electromechanical:BUZZER: Buzzer Small round buzzers that operate around the audible 2kHz range. You can use these as speakers to create simple music or user interfaces. Variant Overview: PTH - Mini Speaker - PC Mount 12mm 2.048kHz <https://www.sparkfun.com/products/7950> PTH_KIT - Mini Speaker - PC Mount 12mm 2.048kHz <https://www.sparkfun.com/products/7950> KIT simplifies soldering by adding stop mask to one side of the pads. PTH_NO_SILK - Mini Speaker - PC Mount 12mm 2.048kHz <https://www.sparkfun.com/products/7950> No silkscreen indicator of buzzer outline. PTH_KIT_NO_SILK - Mini Speaker - PC Mount 12mm 2.048kHz <https://www.sparkfun.com/products/7950> KIT package w/o silkscreen SMD - Buzzer Audio Magnetic (CCV-084B16) SMD buzzer used on, e.g. the LilyPad Buzzer <https://www.sparkfun.com/products/8463> and RFID USB Reader <https://www.sparkfun.com/products/9963>. SMD_KIT - Buzzer Audio Magnetic (CCV-084B16) SMD Buzzer with elongated pins to make soldering easier. Used on the SparkFun Simon Says - Surface Mount Soldering Kit <https://www.sparkfun.com/products/10935>.; PROD_ID: COMP-08253; SF_SKU: COM-07950
PLED1-PLED9 = SparkFun-LED:WS2812-2020
PTR1-PTR10 = TEMD1020:TEMT1020: VISHAY - TEMD1020 - PHOTODIODE, 940NM, 15DEG, SMD Source: Datasheet <https://componentsearchengine.com/Datasheets/1/TEMD1020.pdf>; DESCRIPTION: VISHAY - TEMD1020 - PHOTODIODE, 940NM, 15DEG, SMD; HEIGHT: mm; MANUFACTURER_NAME: Vishay; MANUFACTURER_PART_NUMBER: TEMD1020; MOUSER_PART_NUMBER: 782-TEMD1020; MOUSER_PRICE-STOCK: https://www.mouser.com/Search/Refine.aspx?Keyword=782-TEMD1020; RS_PART_NUMBER: 1808105P; RS_PRICE-STOCK: http://uk.rs-online.com/web/p/products/1808105P
Q1 Q2 Q9 = SBC817-40LT1G:SBC817-40LT1G: NPN Bipolar Transistor, 500 mA 45 V, 3-pin SOT-23 Source: Datasheet <http://www.onsemi.com/pub/Collateral/BC817-16LT1-D.PDF>; ALLIED_NUMBER: 70300549; ALLIED_PRICE-STOCK: http://www.alliedelec.com/on-semiconductor-sbc817-40lt1g/70300549/; DESCRIPTION: NPN Bipolar Transistor, 500 mA 45 V, 3-pin SOT-23; HEIGHT: 1.11mm; MANUFACTURER_NAME: ON Semiconductor; MANUFACTURER_PART_NUMBER: SBC817-40LT1G; MOUSER_PART_NUMBER: 863-SBC817-40LT1G; MOUSER_PRICE-STOCK: https://www.mouser.com/Search/Refine.aspx?Keyword=863-SBC817-40LT1G; RS_PART_NUMBER: 1631159; RS_PRICE-STOCK: http://uk.rs-online.com/web/p/products/1631159
Q3-Q8 = SparkFun-Sensors:LTR-301: LiteOn LTR-301 IR Phototransistor (Side-Receiving) Side-looking Infrared detectors. These simple devices operate at 940nm and work well for generic IR systems including remote control and touch-less object sensing. Using a simple ADC on any microcontroller will allow variable readings to be collected from the detector. Datasheet <http://www.sparkfun.com/datasheets/Components/LTR-301.pdf> SparkFun Products Infrared Emitters and Detectors <https://www.sparkfun.com/products/241> (SEN-00241); PROD_ID: DIO-10904; SF_ID: SEN-00241
R1-R57 = SparkFun-Resistors:RESISTOR: Generic Resistor Package
S1 = 5MS1S102AM2QES:5MS1S102AM2QES: Slide switch,SP,5.08 high PC thru-hole PCB Slide Switch SPDT On-On 5 A@ 28 V dc Top Source: Datasheet <http://docs-emea.rs-online.com/webdocs/13fb/0900766b813fbb35.pdf>; DESCRIPTION: Slide switch,SP,5.08 high PC thru-hole PCB Slide Switch SPDT On-On 5 A@ 28 V dc Top; HEIGHT: mm; MANUFACTURER_NAME: RS Components; MANUFACTURER_PART_NUMBER: 5MS1S102AM2QES; RS_PART_NUMBER: 7347292; RS_PRICE-STOCK: http://uk.rs-online.com/web/p/products/7347292
S2 = SKRHABE010:SKRHABE010: Multi-Directional Switches 4-directn cntr push W/boss 200K Cycles Source: Datasheet <https://www.alps.com/prod/info/E/PDF/MultiControl/Switch/SKRH.pdf>; DESCRIPTION: Multi-Directional Switches 4-directn cntr push W/boss 200K Cycles; HEIGHT: 5mm; MANUFACTURER_NAME: ALPS; MANUFACTURER_PART_NUMBER: SKRHABE010; MOUSER_PART_NUMBER: 688-SKRHAB; MOUSER_PRICE-STOCK: https://www.mouser.com/Search/Refine.aspx?Keyword=688-SKRHAB
S3 S4 = AH186061A:AH186061A: Ultra-miniature Size Switch Source: Datasheet <http://www3.panasonic.biz/ac/e_download/control/switch/micro/catalog/sw_m_eng_ah1.pdf?f_cd=400052>; DESCRIPTION: Ultra-miniature Size Switch; HEIGHT: mm; MANUFACTURER_NAME: Panasonic; MANUFACTURER_PART_NUMBER: AH186061A
SJ1 = jumper:SJ: SMD solder JUMPER
SV1-SV4 = con-lstb:MA04-1: PIN HEADER; OC_FARNELL: unknown; OC_NEWARK: unknown
U1-U12 = NC7SB3157P6X:NC7SB3157P6X: SPDT Analog Switch; AVAILABILITY: Unavailable; DESCRIPTION: NC7SB3157 Series 1.65 to 5.5 V Multiplexer/Demultiplexer Bus Switch - SC-70-6; MF: ON Semiconductor; MP: NC7SB3157P6X; PACKAGE: SC-70-6 ON Semiconductor; PRICE: None